# EAGLE schematic pol-switch-mid-band_unrouted (EAGLE 9.5.1)
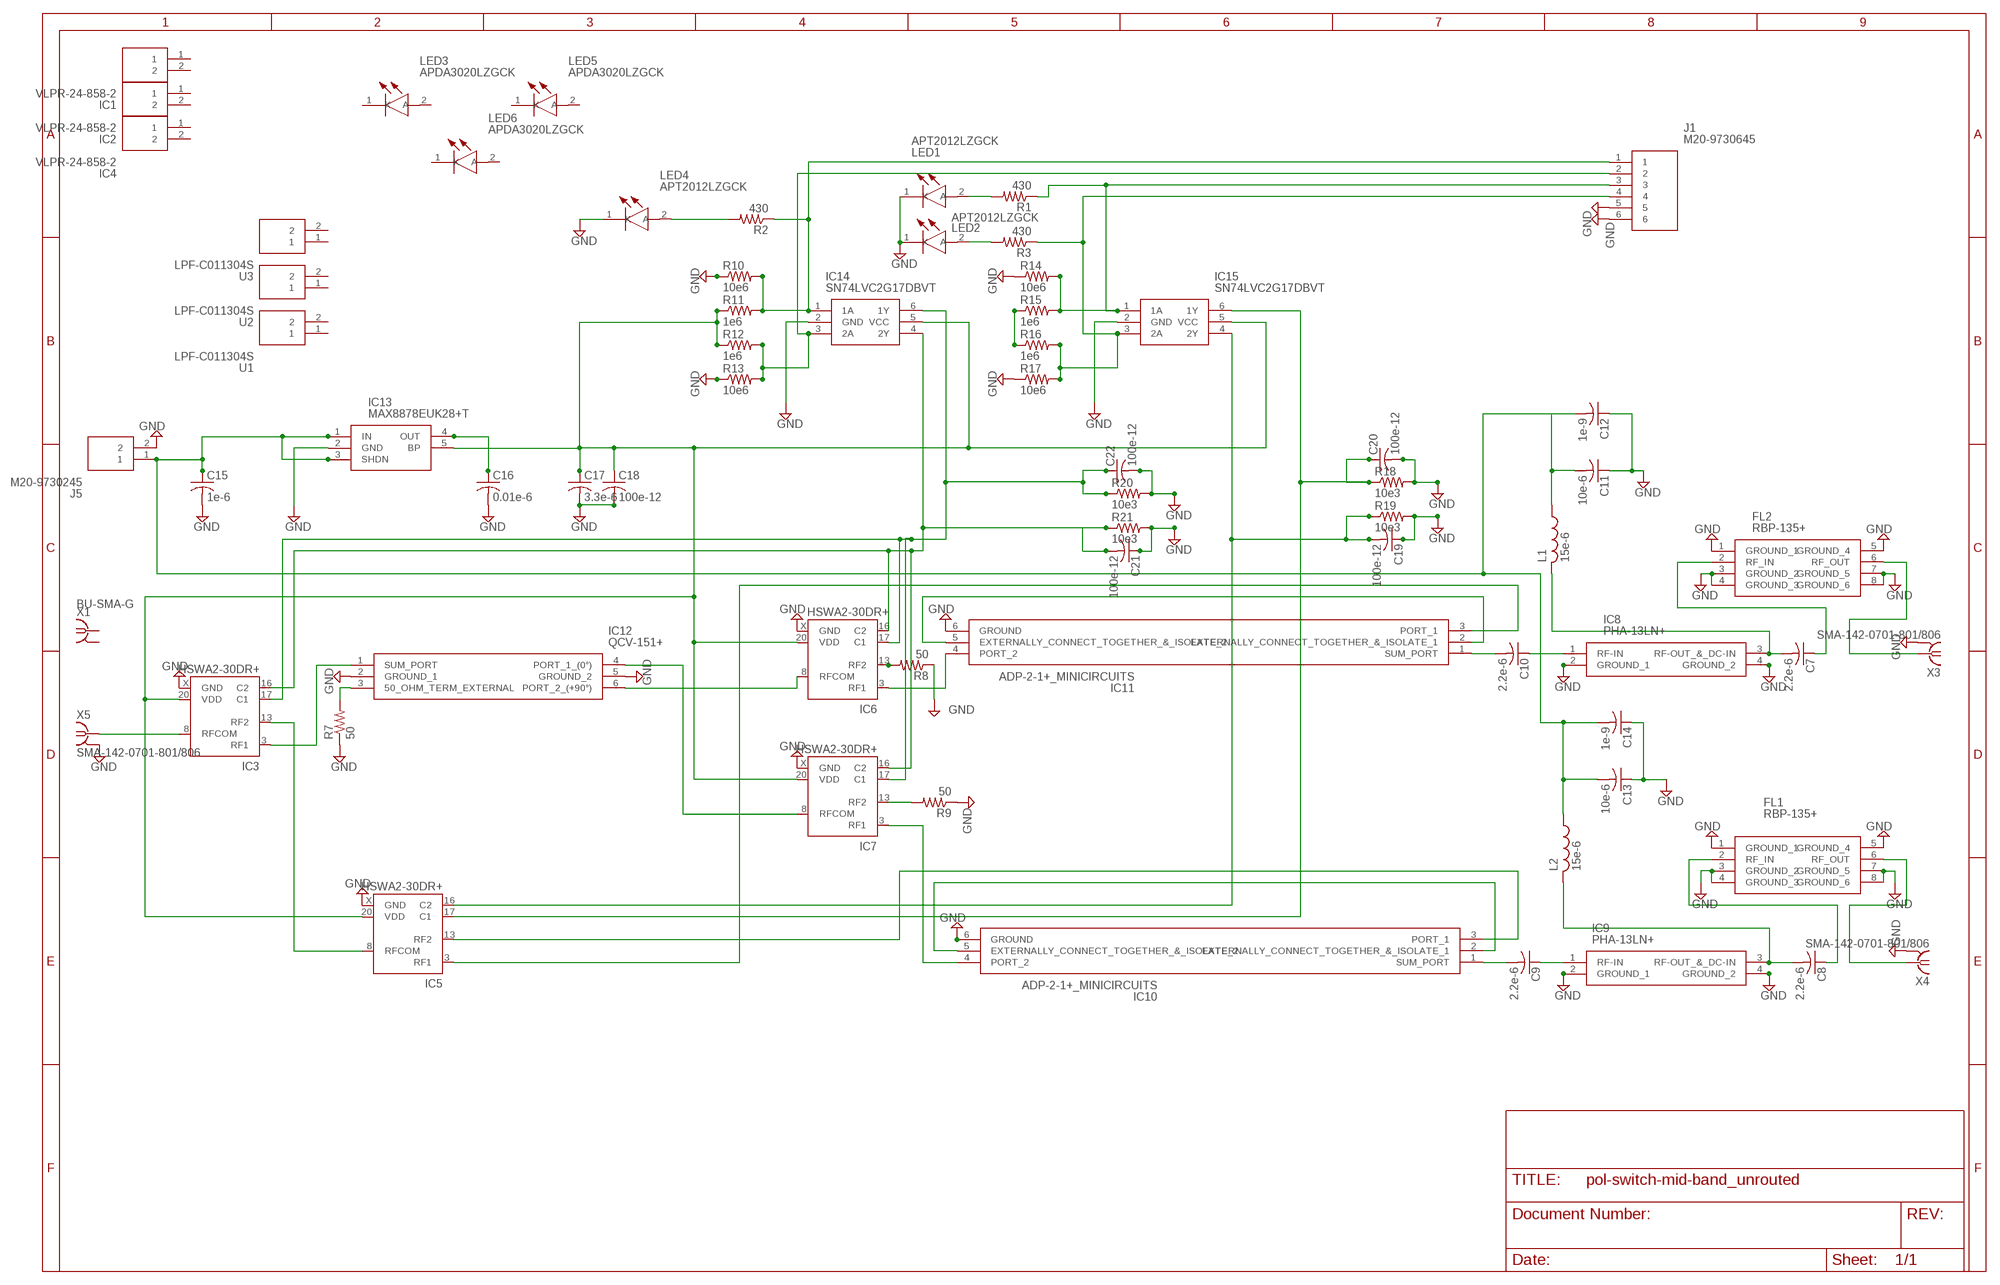
[diagram p0: schematic, sheet 1]

## Parts
C7  2.2e-6  C-USC0603  [C0603]
C8  2.2e-6  C-USC0603  [C0603]
C9  2.2e-6  C-USC0603  [C0603]
C10  2.2e-6  C-USC0603  [C0603]
C11  10e-6  C-USC0603  [C0603]
C12  1e-9  C-USC0603  [C0603]
C13  10e-6  C-USC0603  [C0603]
C14  1e-9  C-USC0603  [C0603]
C15  1e-6  C-USC0603  [C0603]
C16  0.01e-6  C-USC0603  [C0603]
C17  3.3e-6  C-USC0603  [C0603]
C18  100e-12  C-USC0603  [C0603]
C19  100e-12  C-USC0603  [C0603]
C20  100e-12  C-USC0603  [C0603]
C21  100e-12  C-USC0603  [C0603]
C22  100e-12  C-USC0603  [C0603]
FL1  RBP-135+  [RBP135]
FL2  RBP-135+  [RBP135]
IC1  VLPR-24-858-2  [VLPR248582]
IC2  VLPR-24-858-2  [VLPR248582]
IC3  HSWA2-30DR+  [DG983-1]
IC4  VLPR-24-858-2  [VLPR248582]
IC5  HSWA2-30DR+  [DG983-1]
IC6  HSWA2-30DR+  [DG983-1]
IC7  HSWA2-30DR+  [DG983-1]
IC8  PHA-13LN+  [PHA13LN]
IC9  PHA-13LN+  [PHA13LN]
IC10  ADP-2-1+_MINICIRCUITS  [SOTFL254P691X411-6N]
IC11  ADP-2-1+_MINICIRCUITS  [SOTFL254P691X411-6N]
IC12  QCV-151+  [QCV151]
IC13  MAX8878EUK28+T  [SOT95P280X145-5N]
IC14  SN74LVC2G17DBVT  [SOT95P280X145-6N]
IC15  SN74LVC2G17DBVT  [SOT95P280X145-6N]
J1  M20-9730645  [HDRV6W66P0X254_1X6_1524X254X96]
J5  M20-9730245  [M209730245]
L1  15e-6  L-USL3225M  [L3225M]
L2  15e-6  L-USL3225M  [L3225M]
LED1  APT2012LZGCK  [LEDC2012X85N]
LED2  APT2012LZGCK  [LEDC2012X85N]
LED3  APDA3020LZGCK  [APDA3020LZGCK]
LED4  APT2012LZGCK  [LEDC2012X85N]
LED5  APDA3020LZGCK  [APDA3020LZGCK]
LED6  APDA3020LZGCK  [APDA3020LZGCK]
R1  430  R-US_R0603  [R0603]
R2  430  R-US_R0603  [R0603]
R3  430  R-US_R0603  [R0603]
R7  50  R-US_R0603  [R0603]
R8  50  R-US_R0603  [R0603]
R9  50  R-US_R0603  [R0603]
R10  10e6  R-US_R0603  [R0603]
R11  1e6  R-US_R0603  [R0603]
R12  1e6  R-US_R0603  [R0603]
R13  10e6  R-US_R0603  [R0603]
R14  10e6  R-US_R0603  [R0603]
R15  1e6  R-US_R0603  [R0603]
R16  1e6  R-US_R0603  [R0603]
R17  10e6  R-US_R0603  [R0603]
R18  10e3  R-US_R0603  [R0603]
R19  10e3  R-US_R0603  [R0603]
R20  10e3  R-US_R0603  [R0603]
R21  10e3  R-US_R0603  [R0603]
U1  LPF-C011304S  [LPFC011304S]
U2  LPF-C011304S  [LPFC011304S]
U3  LPF-C011304S  [LPFC011304S]
X1  BU-SMA-G  [BU-SMA-G]
X3  SMA-142-0701-801/806  [J502-ND-142-0701-801/806]
X4  SMA-142-0701-801/806  [J502-ND-142-0701-801/806]
X5  SMA-142-0701-801/806  [J502-ND-142-0701-801/806]

## Nets
GND: C11.1 C12.1 C13.1 C14.1 C15.2 C16.2 C17.2 C18.2 C19.1 C20.2 C21.1 C22.2 FL1.1(GROUND_1) FL1.3(GROUND_2) FL1.4(GROUND_3) FL1.5(GROUND_4) FL1.7(GROUND_5) FL1.8(GROUND_6) FL2.1(GROUND_1) FL2.3(GROUND_2) FL2.4(GROUND_3) FL2.5(GROUND_4) FL2.7(GROUND_5) FL2.8(GROUND_6) IC3.X(GND) IC5.X(GND) IC6.X(GND) IC7.X(GND) IC8.2(GROUND_1) IC8.4(GROUND_2) IC9.2(GROUND_1) IC9.4(GROUND_2) IC10.6(GROUND) IC11.6(GROUND) IC12.2(GROUND_1) IC12.5(GROUND_2) IC13.2(GND) IC14.2(GND) IC15.2(GND) J1.5 J1.6 J5.2 LED1.1(K) LED2.1(K) LED4.1(K) R7.1 R8.1 R9.1 R10.1 R13.1 R14.1 R17.1 R18.2 R19.2 R20.2 R21.2 X3.G@1 X3.G@2 X3.G@3 X3.G@4 X4.G@1 X4.G@2 X4.G@3 X4.G@4 X5.G@1 X5.G@2 X5.G@3 X5.G@4
N$1: LED2.2(A) R3.2
N$2: LED1.2(A) R1.2
N$3: LED4.2(A) R2.2
N$4: IC5.13(RF2) IC10.3(PORT_1)
N$5: IC3.8(RFCOM) X5.1
N$6: C10.2 IC11.1(SUM_PORT)
N$7: IC7.3(RF1) IC10.4(PORT_2)
N$8: C20.1 IC5.17(C1) IC15.6(1Y) R18.1
N$9: IC7.8(RFCOM) IC12.4(PORT_1_(0°))
N$13: C10.1 IC8.1(RF-IN)
N$14: IC3.3(RF1) IC12.1(SUM_PORT)
N$15: IC3.13(RF2) IC5.8(RFCOM)
N$16: IC6.8(RFCOM) IC12.6(PORT_2_(+90°))
N$18: IC6.3(RF1) IC11.4(PORT_2)
N$19: IC6.13(RF2) R8.2
N$20: C7.2 IC8.3(RF-OUT_&_DC-IN) L1.2
N$21: C9.2 IC10.1(SUM_PORT)
N$22: IC11.2(EXTERNALLY_CONNECT_TOGETHER_&_ISOLATE_1) IC11.5(EXTERNALLY_CONNECT_TOGETHER_&_ISOLATE_2)
N$23: IC5.3(RF1) IC11.3(PORT_1)
N$25: IC10.2(EXTERNALLY_CONNECT_TOGETHER_&_ISOLATE_1) IC10.5(EXTERNALLY_CONNECT_TOGETHER_&_ISOLATE_2)
N$26: C9.1 IC9.1(RF-IN)
N$27: C8.2 IC9.3(RF-OUT_&_DC-IN) L2.2
N$28: C7.1 FL2.2(RF_IN)
N$29: FL2.6(RF_OUT) X3.1
N$30: C8.1 FL1.2(RF_IN)
N$31: FL1.6(RF_OUT) X4.1
N$32: IC12.3(50_OHM_TERM_EXTERNAL) R7.2
N$35: IC7.13(RF2) R9.2
N$36: C11.2 C12.2 C13.2 C14.2 C15.1 IC13.1(IN) IC13.3(SHDN) J5.1 L1.1 L2.1
N$37: IC14.1(1A) J1.1 R2.1 R10.2 R11.2
N$38: C19.2 IC5.16(C2) IC15.4(2Y) R19.1
N$39: C17.1 C18.1 IC3.20(VDD) IC5.20(VDD) IC6.20(VDD) IC7.20(VDD) IC13.5(BP) IC14.5(VCC) IC15.5(VCC) R11.1 R12.1
N$40: C16.1 IC13.4(OUT)
N$42: C22.1 IC3.17(C1) IC6.17(C1) IC7.17(C1) IC14.6(1Y) R20.1
N$43: IC14.3(2A) J1.2 R12.2 R13.2
N$44: IC15.1(1A) J1.3 R1.1 R14.2 R15.2
N$45: IC15.3(2A) J1.4 R3.1 R16.2 R17.2
N$46: C21.2 IC3.16(C2) IC6.16(C2) IC7.16(C2) IC14.4(2Y) R21.1
N$48: R15.1 R16.1
Unconnected: IC1.1 IC1.2 IC2.1 IC2.2 IC4.1 IC4.2 LED3.1(K) LED3.2(A) LED5.1(K) LED5.2(A) LED6.1(K) LED6.2(A) U1.1 U1.2 U2.1 U2.2 U3.1 U3.2 X1.1 X1.2 X1.3 X1.4 X1.5

## Power pins joined to a net without a drawn wire
GND: IC3.1(GND) IC3.2(GND) IC3.4(GND) IC3.5(GND) IC3.6(GND) IC3.7(GND) IC3.9(GND) IC3.10(GND) IC3.11(GND) IC3.12(GND) IC3.14(GND) IC3.15(GND) IC3.18(GND) IC3.19(GND) IC5.1(GND) IC5.2(GND) IC5.4(GND) IC5.5(GND) IC5.6(GND) IC5.7(GND) IC5.9(GND) IC5.10(GND) IC5.11(GND) IC5.12(GND) IC5.14(GND) IC5.15(GND) IC5.18(GND) IC5.19(GND) IC6.1(GND) IC6.2(GND) IC6.4(GND) IC6.5(GND) IC6.6(GND) IC6.7(GND) IC6.9(GND) IC6.10(GND) IC6.11(GND) IC6.12(GND) IC6.14(GND) IC6.15(GND) IC6.18(GND) IC6.19(GND) IC7.1(GND) IC7.2(GND) IC7.4(GND) IC7.5(GND) IC7.6(GND) IC7.7(GND) IC7.9(GND) IC7.10(GND) IC7.11(GND) IC7.12(GND) IC7.14(GND) IC7.15(GND) IC7.18(GND) IC7.19(GND)

## Library data of the parts
C7-C22 = rcl:C-US: CAPACITOR, American symbol; SPICEPREFIX: C
FL1 FL2 = RBP-135+:RBP-135+: Metal Shield Bandpass Filter Source: Datasheet <https://www.minicircuits.com/pdfs/RBP-135 .pdf>; DESCRIPTION: Metal Shield Bandpass Filter; HEIGHT: 2.54mm; MANUFACTURER_NAME: Mini-Circuits; MANUFACTURER_PART_NUMBER: RBP-135+
IC1 IC2 IC4 = VLPR-24-858-2:VLPR-24-858-2: LED Light Pipes Light Pipe Vert SMD Rect Face Source: Datasheet <http://uk.rs-online.com/web/p/products/9063748>; DESCRIPTION: LED Light Pipes Light Pipe Vert SMD Rect Face; HEIGHT: 21mm; MANUFACTURER_NAME: Bivar; MANUFACTURER_PART_NUMBER: VLPR-24-858-2; RS_PART_NUMBER: 9063748; RS_PRICE-STOCK: http://uk.rs-online.com/web/p/products/9063748
IC3 IC5-IC7 = minicircuits:HSWA2-30DR+: SPDT RF SWITCH Absorptive RF Switch with internal driver Source: http://www.minicircuits.com .. HSWA2-30DR+.pdf; OC_FARNELL: unknown; OC_NEWARK: unknown
IC8 IC9 = PHA-13LN+:PHA-13LN+: ic Source: Datasheet <https://www.minicircuits.com/pdfs/PHA-13LN .pdf>; DESCRIPTION: ic; HEIGHT: 1.6mm; MANUFACTURER_NAME: Mini Circuits; MANUFACTURER_PART_NUMBER: PHA-13LN+
IC10 IC11 = ADP-2-1+_MINICIRCUITS:ADP-2-1+_MINICIRCUITS: Power Splitter/Combiner Source: Datasheet <https://www.minicircuits.com/pdfs/ADP-2-1 .pdf>; DESCRIPTION: Power Splitter/Combiner; HEIGHT: 4.11mm; MANUFACTURER_NAME: Mini-Circuits; MANUFACTURER_PART_NUMBER: ADP-2-1+ MINICIRCUITS
IC12 = QCV-151+:QCV-151+: 2 Way-90 Power Splitter Source: Datasheet <https://www.minicircuits.com/pdfs/QCV-151 .pdf>; DESCRIPTION: 2 Way-90 Power Splitter; HEIGHT: 1.652mm; MANUFACTURER_NAME: Mini-Circuits; MANUFACTURER_PART_NUMBER: QCV-151+
IC13 = MAX8878EUK28+T:MAX8878EUK28+T: LDO Voltage Regulators Low-Noise, Low-Dropout, 150mA Linear Regulators with 2982 Pinout Source: Datasheet <https://www.mouser.com/datasheet/2/256/MAX8878-1389229.pdf>; DESCRIPTION: LDO Voltage Regulators Low-Noise, Low-Dropout, 150mA Linear Regulators with 2982 Pinout; HEIGHT: 1.45mm; MANUFACTURER_NAME: Maxim Integrated; MANUFACTURER_PART_NUMBER: MAX8878EUK28+T
IC14 IC15 = SN74LVC2G17DBVT:SN74LVC2G17DBVT: DUAL SCHMITT-TRIGGER BUFFER Source: Datasheet <http://www.ti.com/lit/gpn/SN74LVC2G17>; DESCRIPTION: DUAL SCHMITT-TRIGGER BUFFER; HEIGHT: 1.45mm; MANUFACTURER_NAME: Texas Instruments; MANUFACTURER_PART_NUMBER: SN74LVC2G17DBVT; MOUSER_PART_NUMBER: 595-SN74LVC2G17DBVT; MOUSER_PRICE-STOCK: https://www.mouser.com/Search/Refine.aspx?Keyword=595-SN74LVC2G17DBVT; RS_PART_NUMBER: 6628944P; RS_PRICE-STOCK: http://uk.rs-online.com/web/p/products/6628944P
J1 = M20-9730645:M20-9730645: Headers & Wire Housings 06 SIL VERTICAL PIN HEADER GOLD HT Source: Datasheet <https://cdn.harwin.com/pdfs/C001XX_M20_Series_Connectors.pdf>; DESCRIPTION: Headers & Wire Housings 06 SIL VERTICAL PIN HEADER GOLD HT; HEIGHT: 9.64mm; MANUFACTURER_NAME: HARWIN; MANUFACTURER_PART_NUMBER: M20-9730645; MOUSER_PART_NUMBER: 855-M20-9730645; MOUSER_PRICE-STOCK: https://www.mouser.com/Search/Refine.aspx?Keyword=855-M20-9730645
J5 = M20-9730245:M20-9730245: Headers & Wire Housings 02 SIL VERTICAL PIN HEADER GOLD HT Source: Datasheet <https://www.mouser.com/datasheet/2/181/M20-973-1273432.pdf>; DESCRIPTION: Headers & Wire Housings 02 SIL VERTICAL PIN HEADER GOLD HT; HEIGHT: 9.79mm; MANUFACTURER_NAME: HARWIN; MANUFACTURER_PART_NUMBER: M20-9730245; MOUSER_PART_NUMBER: 855-M20-9730245; MOUSER_PRICE-STOCK: https://www.mouser.com/Search/Refine.aspx?Keyword=855-M20-9730245
L1 L2 = rcl:L-US: INDUCTOR, American symbol; SPICEPREFIX: L
LED1 LED2 LED4 = APT2012LZGCK:APT2012LZGCK: Standard LEDs - SMD 2.0X1.2MM LOW CRNT Source: Datasheet <http://www.kingbrightusa.com/images/catalog/SPEC/APT2012LZGCK.pdf>; ALLIED_NUMBER: 71056205; ALLIED_PRICE-STOCK: https://www.alliedelec.com/kingbright-apt2012lzgck/71056205/; DESCRIPTION: Standard LEDs - SMD 2.0X1.2MM LOW CRNT; HEIGHT: 0.85mm; MANUFACTURER_NAME: Kingbright; MANUFACTURER_PART_NUMBER: APT2012LZGCK; MOUSER_PART_NUMBER: 604-APT2012LZGCK; MOUSER_PRICE-STOCK: https://www.mouser.com/Search/Refine.aspx?Keyword=604-APT2012LZGCK
LED3 LED5 LED6 = APDA3020LZGCK:APDA3020LZGCK: Standard LEDs - SMD 3.0X2.0MM RA. GREEN SMD Source: Datasheet <https://www.mouser.com/datasheet/2/216/APDA3020LZGCK-535649.pdf>; DESCRIPTION: Standard LEDs - SMD 3.0X2.0MM RA. GREEN SMD; HEIGHT: mm; MANUFACTURER_NAME: Kingbright; MANUFACTURER_PART_NUMBER: APDA3020LZGCK; MOUSER_PART_NUMBER: 604-APDA3020LZGCK; MOUSER_PRICE-STOCK: https://www.mouser.com/Search/Refine.aspx?Keyword=604-APDA3020LZGCK
R1-R3 R7-R21 = rcl:R-US_: RESISTOR, American symbol; SPICEPREFIX: R
U1-U3 = LPF-C011304S:LPF-C011304S: LED Light Pipes RA Light Pipe Clr 2.8mm Round Source: Datasheet <https://www.mouser.com/datasheet/2/244/826201523801-LPF-C011304S-1134705.pdf>; DESCRIPTION: LED Light Pipes RA Light Pipe Clr 2.8mm Round; HEIGHT: 5.1mm; MANUFACTURER_NAME: Lumex; MANUFACTURER_PART_NUMBER: LPF-C011304S; MOUSER_PART_NUMBER: 696-LPF-C011304S; MOUSER_PRICE-STOCK: https://www.mouser.com/Search/Refine.aspx?Keyword=696-LPF-C011304S; RS_PART_NUMBER: 8885925; RS_PRICE-STOCK: http://uk.rs-online.com/web/p/products/8885925
X1 = con-coax:BU-SMA-G: FEMALE SMA CONNECTOR Radiall distributor RS 193-9117; OC_FARNELL: unknown; OC_NEWARK: unknown
X3-X5 = sma-flange_375mils:SMA-: SMA 50 Ohm End Launch Jack Receptacle - Round Contact Johnson Components Source: www.johnsoncomponents.com .. J502-ND.pdf; MF: JOHNSON COMPONENTS; MPN: 142-0701-801; OC_FARNELL: 1608592; OC_NEWARK: 90F2624